# EAGLE schematic DW08B (EAGLE 6.6.0)
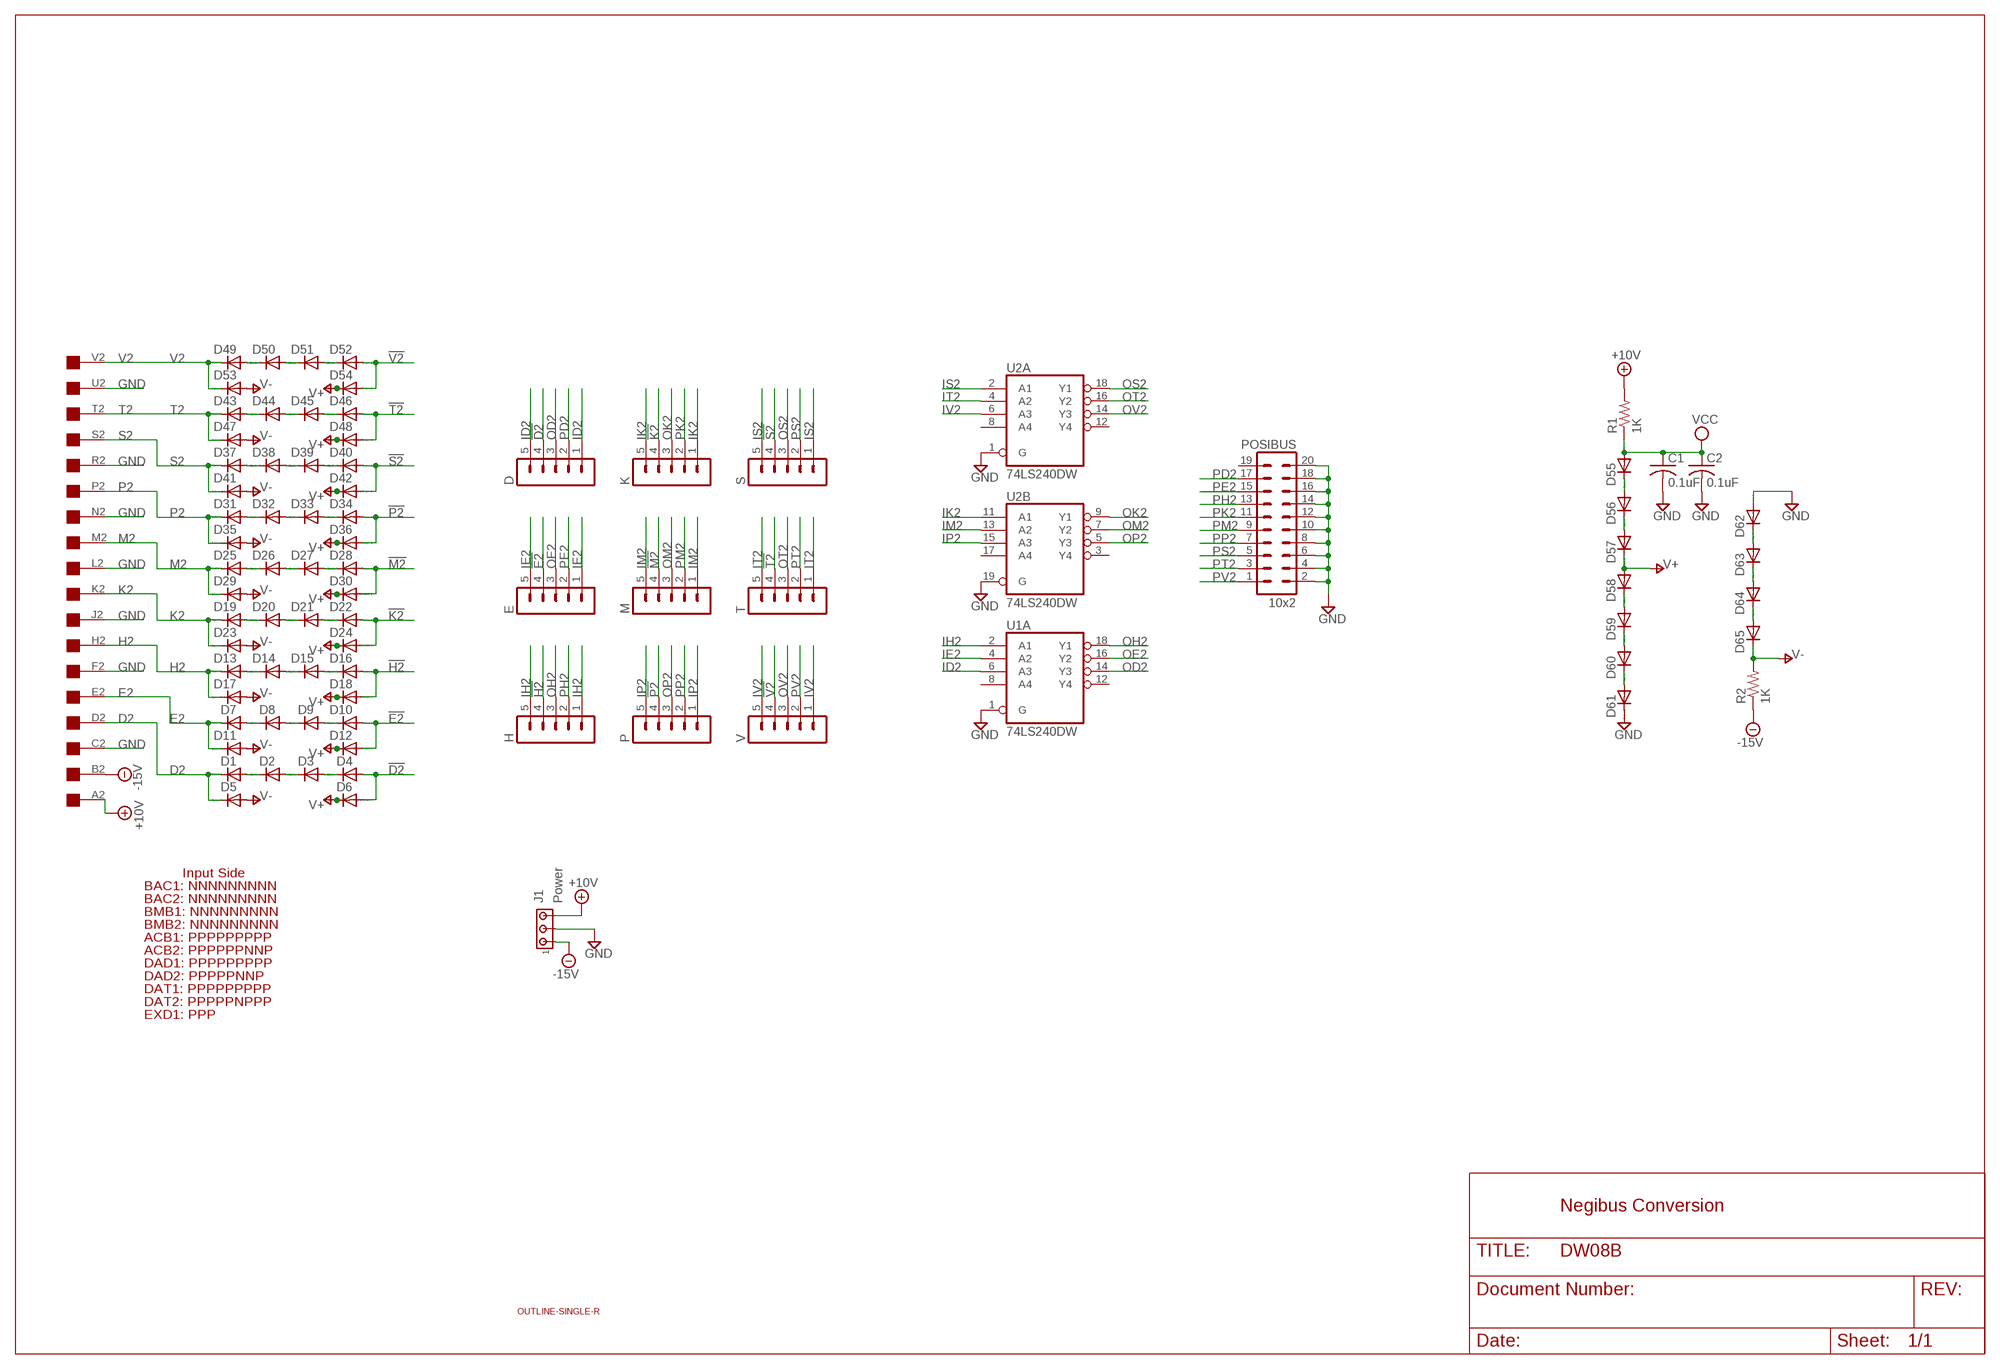
[diagram p0: schematic, sheet 1]

## Parts
C1  0.1uF  C-US050-025X075  [C050-025X075]
C2  0.1uF  C-US050-025X075  [C050-025X075]
D  MA05-1  [MA05-1]
D1  1N4148WS  DIODE-SOD323-W  [SOD323-W]
D2  1N4148WS  DIODE-SOD323-W  [SOD323-W]
D3  1N4148WS  DIODE-SOD323-W  [SOD323-W]
D4  1N4148WS  DIODE-SOD323-W  [SOD323-W]
D5  1N4148WS  DIODE-SOD323-W  [SOD323-W]
D6  1N4148WS  DIODE-SOD323-W  [SOD323-W]
D7  1N4148WS  DIODE-SOD323-W  [SOD323-W]
D8  1N4148WS  DIODE-SOD323-W  [SOD323-W]
D9  1N4148WS  DIODE-SOD323-W  [SOD323-W]
D10  1N4148WS  DIODE-SOD323-W  [SOD323-W]
D11  1N4148WS  DIODE-SOD323-W  [SOD323-W]
D12  1N4148WS  DIODE-SOD323-W  [SOD323-W]
D13  1N4148WS  DIODE-SOD323-W  [SOD323-W]
D14  1N4148WS  DIODE-SOD323-W  [SOD323-W]
D15  1N4148WS  DIODE-SOD323-W  [SOD323-W]
D16  1N4148WS  DIODE-SOD323-W  [SOD323-W]
D17  1N4148WS  DIODE-SOD323-W  [SOD323-W]
D18  1N4148WS  DIODE-SOD323-W  [SOD323-W]
D19  1N4148WS  DIODE-SOD323-W  [SOD323-W]
D20  1N4148WS  DIODE-SOD323-W  [SOD323-W]
D21  1N4148WS  DIODE-SOD323-W  [SOD323-W]
D22  1N4148WS  DIODE-SOD323-W  [SOD323-W]
D23  1N4148WS  DIODE-SOD323-W  [SOD323-W]
D24  1N4148WS  DIODE-SOD323-W  [SOD323-W]
D25  1N4148WS  DIODE-SOD323-W  [SOD323-W]
D26  1N4148WS  DIODE-SOD323-W  [SOD323-W]
D27  1N4148WS  DIODE-SOD323-W  [SOD323-W]
D28  1N4148WS  DIODE-SOD323-W  [SOD323-W]
D29  1N4148WS  DIODE-SOD323-W  [SOD323-W]
D30  1N4148WS  DIODE-SOD323-W  [SOD323-W]
D31  1N4148WS  DIODE-SOD323-W  [SOD323-W]
D32  1N4148WS  DIODE-SOD323-W  [SOD323-W]
D33  1N4148WS  DIODE-SOD323-W  [SOD323-W]
D34  1N4148WS  DIODE-SOD323-W  [SOD323-W]
D35  1N4148WS  DIODE-SOD323-W  [SOD323-W]
D36  1N4148WS  DIODE-SOD323-W  [SOD323-W]
D37  1N4148WS  DIODE-SOD323-W  [SOD323-W]
D38  1N4148WS  DIODE-SOD323-W  [SOD323-W]
D39  1N4148WS  DIODE-SOD323-W  [SOD323-W]
D40  1N4148WS  DIODE-SOD323-W  [SOD323-W]
D41  1N4148WS  DIODE-SOD323-W  [SOD323-W]
D42  1N4148WS  DIODE-SOD323-W  [SOD323-W]
D43  1N4148WS  DIODE-SOD323-W  [SOD323-W]
D44  1N4148WS  DIODE-SOD323-W  [SOD323-W]
D45  1N4148WS  DIODE-SOD323-W  [SOD323-W]
D46  1N4148WS  DIODE-SOD323-W  [SOD323-W]
D47  1N4148WS  DIODE-SOD323-W  [SOD323-W]
D48  1N4148WS  DIODE-SOD323-W  [SOD323-W]
D49  1N4148WS  DIODE-SOD323-W  [SOD323-W]
D50  1N4148WS  DIODE-SOD323-W  [SOD323-W]
D51  1N4148WS  DIODE-SOD323-W  [SOD323-W]
D52  1N4148WS  DIODE-SOD323-W  [SOD323-W]
D53  1N4148WS  DIODE-SOD323-W  [SOD323-W]
D54  1N4148WS  DIODE-SOD323-W  [SOD323-W]
D55  1N4148WS  DIODE-SOD323-W  [SOD323-W]
D56  1N4148WS  DIODE-SOD323-W  [SOD323-W]
D57  1N4148WS  DIODE-SOD323-W  [SOD323-W]
D58  1N4148WS  DIODE-SOD323-W  [SOD323-W]
D59  1N4148WS  DIODE-SOD323-W  [SOD323-W]
D60  1N4148WS  DIODE-SOD323-W  [SOD323-W]
D61  1N4148WS  DIODE-SOD323-W  [SOD323-W]
D62  1N4148WS  DIODE-SOD323-W  [SOD323-W]
D63  1N4148WS  DIODE-SOD323-W  [SOD323-W]
D64  1N4148WS  DIODE-SOD323-W  [SOD323-W]
D65  1N4148WS  DIODE-SOD323-W  [SOD323-W]
E  MA05-1  [MA05-1]
H  MA05-1  [MA05-1]
J1  Power  MTA03-100  [10X03MTA]
K  MA05-1  [MA05-1]
M  MA05-1  [MA05-1]
P  MA05-1  [MA05-1]
POSIBUS  10x2  MA10-2  [MA10-2]
R1  1K  R-US_0207/10  [0207/10]
R2  1K  R-US_0207/10  [0207/10]
S  MA05-1  [MA05-1]
T  MA05-1  [MA05-1]
U1  74LS240DW  [SO20W]
U2  74LS240DW  [SO20W]
U$1  OUTLINE-SINGLE-R  [SINGLE-R]
U$2  EDGE  SINGLE  [EDGE-CON2]
V  MA05-1  [MA05-1]

## Nets
!D2: D4.A D6.A D.4
!E2: D10.A D12.A E.4
!H2: D16.A D18.A H.4
!K2: D22.A D24.A K.4
!M2: D28.A D30.A M.4
!P2: D34.A D36.A P.4
!S2: D40.A D42.A S.4
!T2: D46.A D48.A T.4
!V2: D52.A D54.A V.4
+10V: J1.3 R1.2 U$2.A2
-15V: J1.1 R2.1 U$2.B2
D2: D1.C D5.C U$2.D2
E2: D7.C D11.C U$2.E2
GND [Ground]: C1.2 C2.2 D61.C D62.A J1.2 POSIBUS.2 POSIBUS.4 POSIBUS.6 POSIBUS.8 POSIBUS.10 POSIBUS.12 POSIBUS.14 POSIBUS.16 POSIBUS.18 POSIBUS.20 U1.1(A:G) U2.1(A:G) U2.19(B:G) U$2.C2 U$2.F2 U$2.J2 U$2.L2 U$2.N2 U$2.R2 U$2.U2
H2: D13.C D17.C U$2.H2
ID2: D.1 D.5 U1.6(A:A3)
IE2: E.1 E.5 U1.4(A:A2)
IH2: H.1 H.5 U1.2(A:A1)
IK2: K.1 K.5 U2.11(B:A1)
IM2: M.1 M.5 U2.13(B:A2)
IP2: P.1 P.5 U2.15(B:A3)
IS2: S.1 S.5 U2.2(A:A1)
IT2: T.1 T.5 U2.4(A:A2)
IV2: U2.6(A:A3) V.1 V.5
K2: D19.C D23.C U$2.K2
M2: D25.C D29.C U$2.M2
N$1: D13.A D14.C
N$2: D1.A D2.C
N$3: D2.A D3.C
N$4: D3.A D4.C
N$5: D14.A D15.C
N$6: D15.A D16.C
N$7: D7.A D8.C
N$8: D8.A D9.C
N$9: D9.A D10.C
N$10: D19.A D20.C
N$11: D20.A D21.C
N$12: D21.A D22.C
N$13: D25.A D26.C
N$14: D26.A D27.C
N$15: D27.A D28.C
N$16: D31.A D32.C
N$17: D32.A D33.C
N$18: D33.A D34.C
N$19: D37.A D38.C
N$20: D38.A D39.C
N$21: D39.A D40.C
N$22: D43.A D44.C
N$23: D44.A D45.C
N$24: D45.A D46.C
N$25: D49.A D50.C
N$26: D50.A D51.C
N$27: D51.A D52.C
N$28: D55.C D56.A
N$29: D56.C D57.A
N$30: D62.C D63.A
N$31: D58.C D59.A
N$32: D59.C D60.A
N$33: D60.C D61.A
N$34: D63.C D64.A
N$35: D64.C D65.A
OD2: D.3 U1.14(A:Y3)
OE2: E.3 U1.16(A:Y2)
OH2: H.3 U1.18(A:Y1)
OK2: K.3 U2.9(B:Y1)
OM2: M.3 U2.7(B:Y2)
OP2: P.3 U2.5(B:Y3)
OS2: S.3 U2.18(A:Y1)
OT2: T.3 U2.16(A:Y2)
OV2: U2.14(A:Y3) V.3
P2: D31.C D35.C U$2.P2
PD2: D.2 POSIBUS.17
PE2: E.2 POSIBUS.15
PH2: H.2 POSIBUS.13
PK2: K.2 POSIBUS.11
PM2: M.2 POSIBUS.9
PP2: P.2 POSIBUS.7
PS2: POSIBUS.5 S.2
PT2: POSIBUS.3 T.2
PV2: POSIBUS.1 V.2
S2: D37.C D41.C U$2.S2
T2: D43.C D47.C U$2.T2
V2: D49.C D53.C U$2.V2
V+: D6.C D12.C D18.C D24.C D30.C D36.C D42.C D48.C D54.C D57.C D58.A
V-: D5.A D11.A D17.A D23.A D29.A D35.A D41.A D47.A D53.A D65.C R2.2
VCC: C1.1 C2.1 D55.A R1.1
Unconnected: POSIBUS.19 U1.3(B:Y4) U1.5(B:Y3) U1.7(B:Y2) U1.8(A:A4) U1.9(B:Y1) U1.11(B:A1) U1.12(A:Y4) U1.13(B:A2) U1.15(B:A3) U1.17(B:A4) U1.19(B:G) U2.3(B:Y4) U2.8(A:A4) U2.12(A:Y4) U2.17(B:A4) U$2.A1 U$2.B1 U$2.C1 U$2.D1 U$2.E1 U$2.F1 U$2.H1 U$2.J1 U$2.K1 U$2.L1 U$2.M1 U$2.N1 U$2.P1 U$2.R1 U$2.S1 U$2.T1 U$2.U1 U$2.V1

## Notes on the sheet
- Input Side
- BAC1: NNNNNNNNN
- BAC2: NNNNNNNNN
- BMB1: NNNNNNNNN
- BMB2: NNNNNNNNN
- ACB1: PPPPPPPPP
- ACB2: PPPPPPNNP
- DAD1: PPPPPPPPP
- DAD2: PPPPPNNP
- DAT1: PPPPPPPPP
- DAT2: PPPPPNPPP
- EXD1: PPP
- Negibus Conversion

## Power pins joined to a net without a drawn wire
GND: U1.10(P:GND) U2.10(P:GND)
VCC: U1.20(P:VCC) U2.20(P:VCC)

## Library data of the parts
C1 C2 = rcl:C-US: CAPACITOR, American symbol
D E H K M P S T V = con-lstb:MA05-1: PIN HEADER; OC_FARNELL: unknown; OC_NEWARK: unknown
D1-D65 = diode:DIODE-: DIODE
J1 = con-amp:MTA03-100: AMP connector
POSIBUS = con-lstb:MA10-2: PIN HEADER; OC_FARNELL: unknown; OC_NEWARK: unknown
R1 R2 = rcl:R-US_: RESISTOR, American symbol
U1 U2 = 74xx-us:74*240: Octal BUFFER and LINE DRIVER, 3-state
U$1 = dec-con:OUTLINE-*: Board outlines for DEC boards.
U$2 = dec-con:SINGLE: Single-Height DEC board